# EAGLE schematic Teensy Fan Controller (EAGLE 9.6.1)
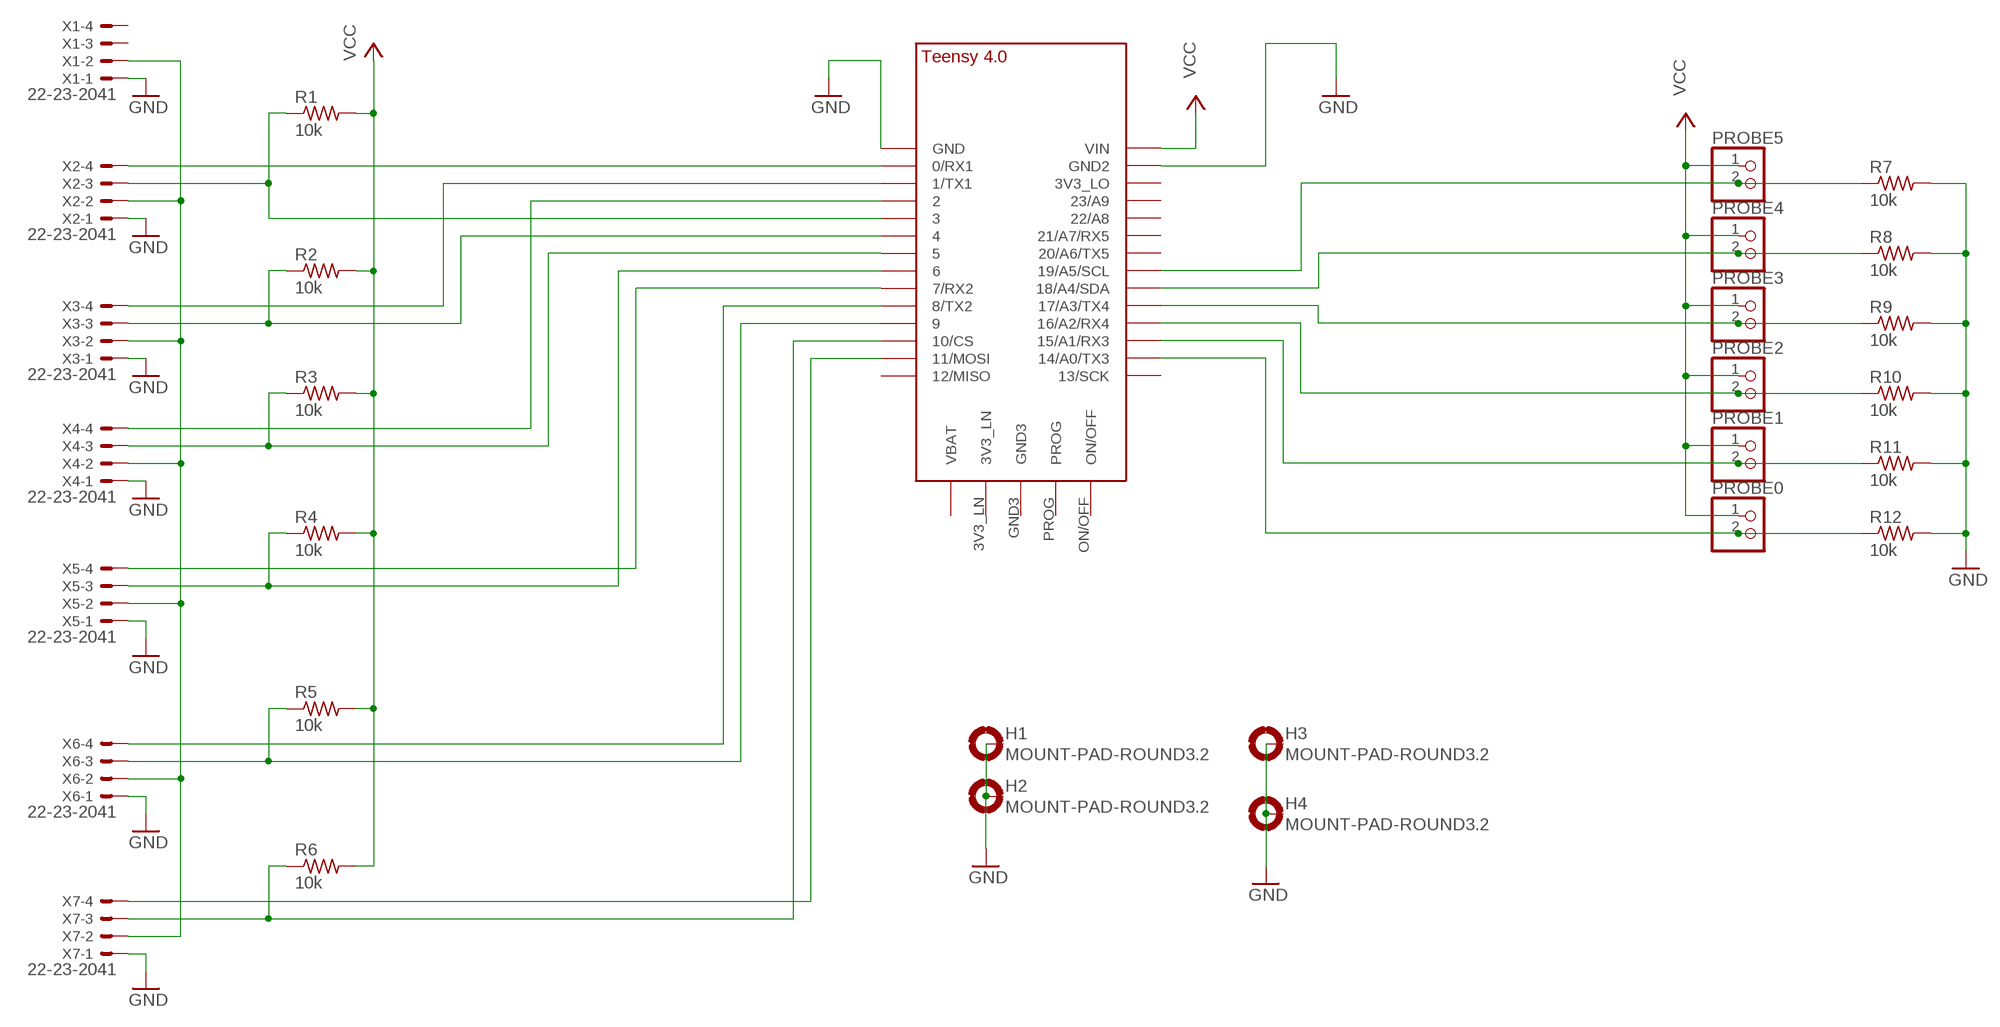
[diagram p0: schematic, sheet 1]

## Parts
H1  MOUNT-PAD-ROUND3.2  [3,2-PAD]
H2  MOUNT-PAD-ROUND3.2  [3,2-PAD]
H3  MOUNT-PAD-ROUND3.2  [3,2-PAD]
H4  MOUNT-PAD-ROUND3.2  [3,2-PAD]
PROBE0  PINHD-1X2  [1X02]
PROBE1  PINHD-1X2  [1X02]
PROBE2  PINHD-1X2  [1X02]
PROBE3  PINHD-1X2  [1X02]
PROBE4  PINHD-1X2  [1X02]
PROBE5  PINHD-1X2  [1X02]
R1  10k  R-US_0207/10  [0207/10]
R2  10k  R-US_0207/10  [0207/10]
R3  10k  R-US_0207/10  [0207/10]
R4  10k  R-US_0207/10  [0207/10]
R5  10k  R-US_0207/10  [0207/10]
R6  10k  R-US_0207/10  [0207/10]
R7  10k  R-US_0207/10  [0207/10]
R8  10k  R-US_0207/10  [0207/10]
R9  10k  R-US_0207/10  [0207/10]
R10  10k  R-US_0207/10  [0207/10]
R11  10k  R-US_0207/10  [0207/10]
R12  10k  R-US_0207/10  [0207/10]
U$2  TEENSY_4.0  [TEENSY_4.0]
X1  22-23-2041  [22-23-2041]
X2  22-23-2041  [22-23-2041]
X3  22-23-2041  [22-23-2041]
X4  22-23-2041  [22-23-2041]
X5  22-23-2041  [22-23-2041]
X6  22-23-2041  [22-23-2041]
X7  22-23-2041  [22-23-2041]

## Nets
GND: H1.B3,2(MOUNT) H2.B3,2(MOUNT) H3.B3,2(MOUNT) H4.B3,2(MOUNT) R7.2 R8.2 R9.2 R10.2 R11.2 R12.2 U$2.GND U$2.GND2 X1.1 X2.1 X3.1 X4.1 X5.1 X6.1 X7.1
N$1: R1.1 U$2.3/CANTX X2.3
N$2: R2.1 U$2.4/CANRX X3.3
N$3: R3.1 U$2.5 X4.3
N$4: U$2.7(7/RX2) X5.4
N$5: U$2.0/RX(0/RX1) X2.4
N$7: U$2.2 X4.4
N$8: R4.1 U$2.6 X5.3
N$9: X1.2 X2.2 X3.2 X4.2 X5.2 X6.2 X7.2
N$10: R6.1 U$2.10/CS X7.3
N$11: U$2.8(8/TX2) X6.4
N$12: R5.1 U$2.9/CS X6.3
N$14: U$2.11/MOSI X7.4
N$20: PROBE5.2 R7.1 U$2.19/A5/SCL
N$21: PROBE4.2 R8.1 U$2.18/A4/SDA
N$22: PROBE3.2 R9.1 U$2.17/A3(17/A3/TX4)
N$23: PROBE2.2 R10.1 U$2.16/A2(16/A2/RX4)
N$24: PROBE1.2 R11.1 U$2.15/A1(15/A1/RX3)
N$25: PROBE0.2 R12.1 U$2.14/A0(14/A0/TX3)
N$28: U$2.1/TX(1/TX1) X3.4
VCC: PROBE0.1 PROBE1.1 PROBE2.1 PROBE3.1 PROBE4.1 PROBE5.1 R1.2 R2.2 R3.2 R4.2 R5.2 R6.2 U$2.VIN
Unconnected: U$2.3V3_LN U$2.3V3_LO U$2.12/MISO U$2.13/SCK U$2.20/A6(20/A6/TX5) U$2.21/A7(21/A7/RX5) U$2.22/A8 U$2.23/A9 U$2.GND3 U$2.ON/OFF U$2.PROG U$2.VBAT\(VBAT) X1.3 X1.4

## Library data of the parts
H1-H4 = holes:MOUNT-PAD-ROUND: MOUNTING PAD, round
PROBE0 PROBE1-PROBE5 = pinhead:PINHD-1X2: PIN HEADER
R1-R12 = rcl:R-US_: RESISTOR, American symbol; SPICEPREFIX: R
U$2 = TEENSY 4.0:TEENSY_4.0
X1-X7 = con-molex:22-23-2041: .100" (2.54mm) Center Header - 4 Pin; MF: MOLEX; MPN: 22-23-2041; OC_FARNELL: 1462920; OC_NEWARK: 38C0355